# EAGLE schematic frets-shift (EAGLE 6.6.0)
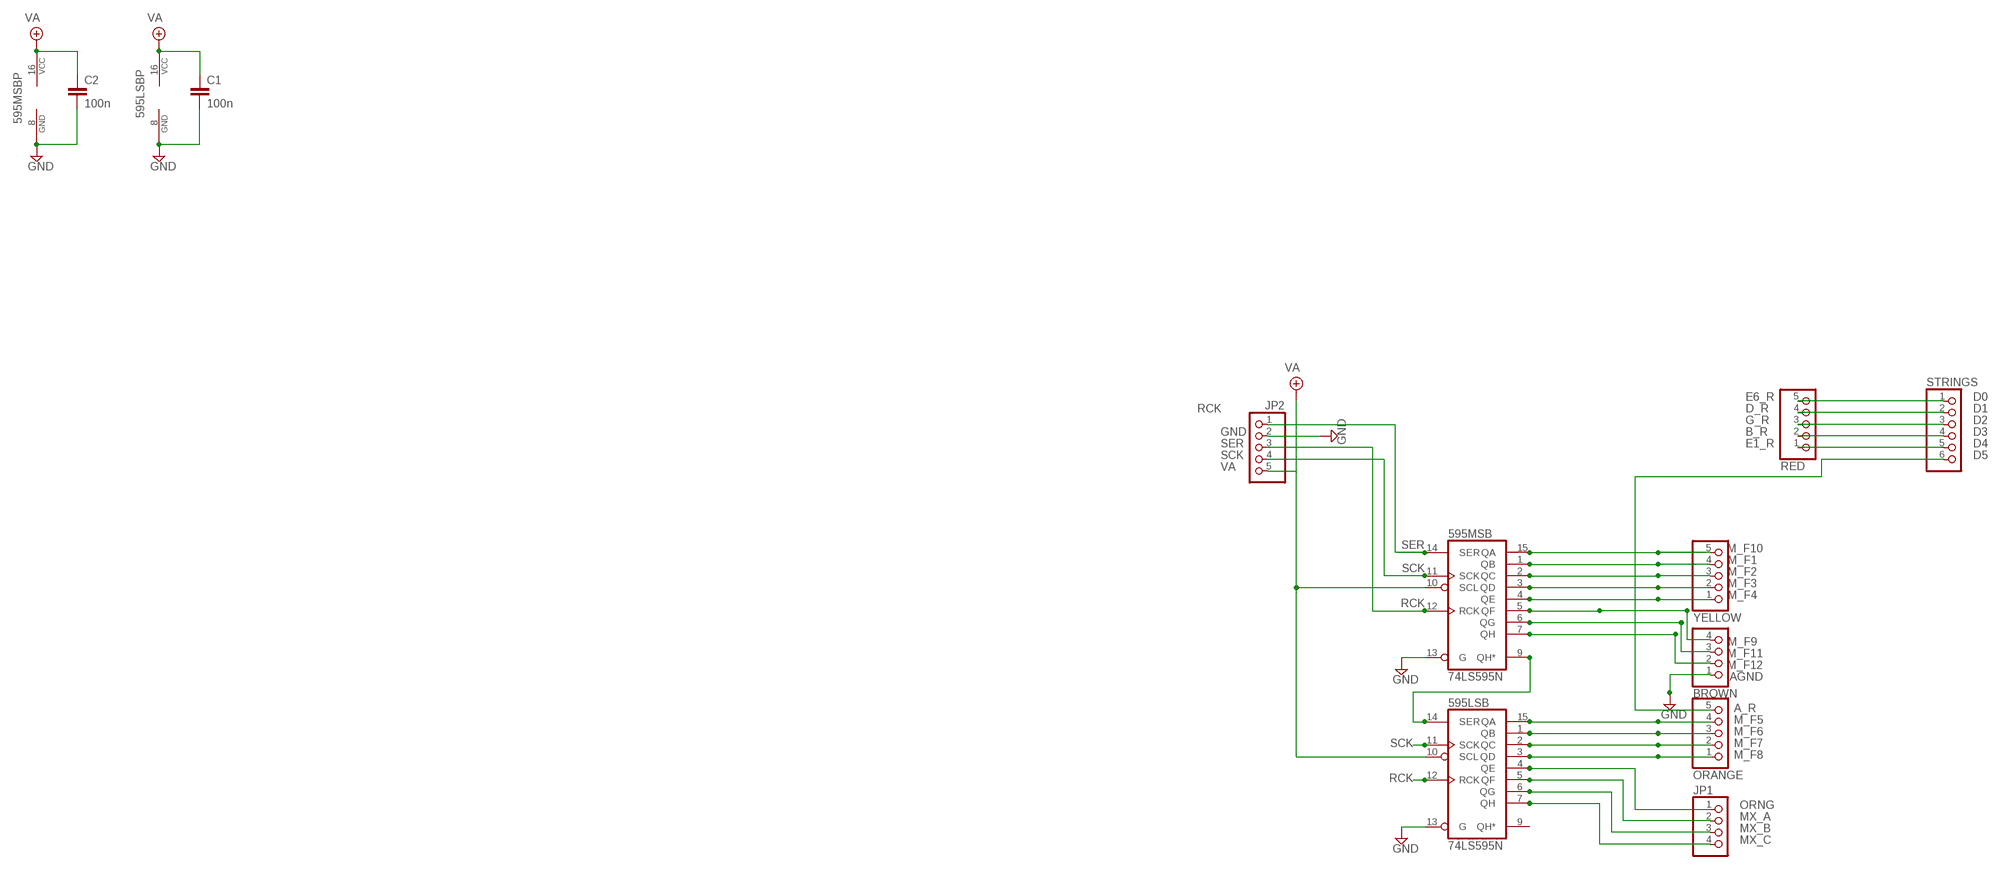
[diagram p0: schematic, sheet 1]

## Parts
595LSB  74LS595N  [DIL16]
595MSB  74LS595N  [DIL16]
BROWN  PINHD-1X4  [1X04]
C1  100n  050X030_050  [050X030_050_3]
C2  100n  050X030_050  [050X030_050_3]
JP1  PINHD-1X4  [1X04]
JP2  PINHD-1X5  [1X05]
ORANGE  PINHD-1X5  [1X05]
RED  PINHD-1X5  [1X05]
STRINGS  PINHD-1X6  [1X06]
YELLOW  PINHD-1X5  [1X05]

## Nets
D0: RED.5 STRINGS.1
D1: RED.4 STRINGS.2
D2: RED.3 STRINGS.3
D3: RED.2 STRINGS.4
D4: RED.1 STRINGS.5
D5: ORANGE.5 STRINGS.6
GND: 595LSB.8(GND) 595LSB.13(G) 595MSB.8(GND) 595MSB.13(G) BROWN.1 C1.2 C2.2 JP2.2
MX_A: 595LSB.5(QF) JP1.2
MX_B: 595LSB.6(QG) JP1.3
MX_C: 595LSB.7(QH) JP1.4
N$1: 595LSB.14(SER) 595MSB.9(QH*)
ORNG: 595LSB.4(QE) JP1.1
RCK: 595LSB.12(RCK) 595MSB.12(RCK) JP2.3
SCK: 595LSB.11(SCK) 595MSB.11(SCK) JP2.4
SER: 595MSB.14(SER) JP2.1
SR4: 595LSB.3(QD) ORANGE.1
SR5: 595LSB.2(QC) ORANGE.2
SR6: 595LSB.1(QB) ORANGE.3
SR7: 595LSB.15(QA) ORANGE.4
SR8: 595MSB.7(QH) BROWN.2
SR9: 595MSB.6(QG) BROWN.3
SR10: 595MSB.5(QF) BROWN.4
SR11: 595MSB.4(QE) YELLOW.1
SR12: 595MSB.3(QD) YELLOW.2
SR13: 595MSB.2(QC) YELLOW.3
SR14: 595MSB.1(QB) YELLOW.4
SR15: 595MSB.15(QA) YELLOW.5
VA: 595LSB.10(SCL) 595LSB.16(VCC) 595MSB.10(SCL) 595MSB.16(VCC) C1.1 C2.1 JP2.5
Unconnected: 595LSB.9(QH*)

## Notes on the sheet
- E6_R
- D_R
- G_R
- B_R
- E1_R
- M_F10
- M_F1
- M_F2
- M_F3
- M_F4
- M_F9
- M_F11
- M_F12
- AGND
- A_R
- M_F5
- M_F6
- M_F7
- M_F8

## Library data of the parts
595LSB 595MSB = 74xx-us:74*595: 8-bit SHIFT REGISTER, output latch
BROWN JP1 = pinhead:PINHD-1X4: PIN HEADER
C1 C2 = gm-caps-ceramic:050X030_050: 120 - 150pF Xicon Ceramic Disc 5mm lead spacing
JP2 ORANGE RED YELLOW = pinhead:PINHD-1X5: PIN HEADER
STRINGS = pinhead:PINHD-1X6: PIN HEADER